# EAGLE design battery_tester (EAGLE 8.6.0)

## Sheet 1 of 2
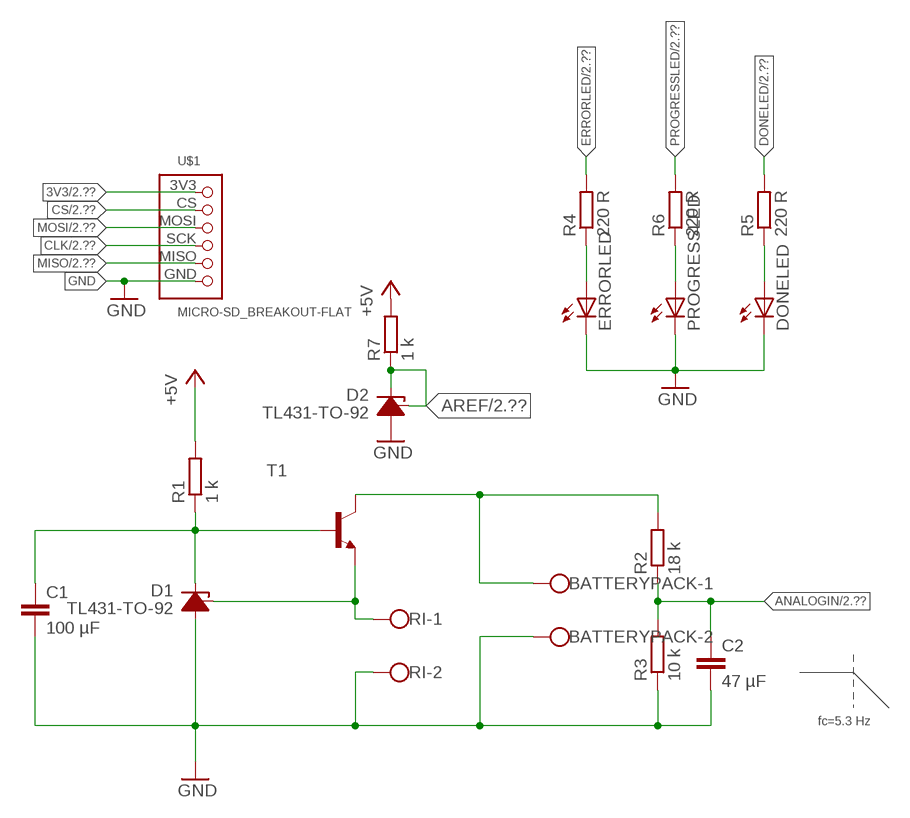
[diagram p0: schematic, sheet 1]

### Parts
BATTERYPACK  W237-102  [W237-102]
C1  100 µF  C-EUC1206  [C1206]
C2  47 µF  C-EUC1206  [C1206]
D1  TL431-TO-92  [TO-92]
D2  TL431-TO-92  [TO-92]
DONELED  LEDSML1206  [SML1206]
ERRORLED  LEDSML1206  [SML1206]
PROGRESSLED  LEDSML1206  [SML1206]
R1  1 k  R-EU_R1206  [R1206]
R2  18 k  R-EU_R1206  [R1206]
R3  10 k  R-EU_R1206  [R1206]
R4  220 R  R-EU_R1206  [R1206]
R5  220 R  R-EU_R1206  [R1206]
R6  220 R  R-EU_R1206  [R1206]
R7  1 k  R-EU_R1206  [R1206]
RI  W237-102  [W237-102]
T1  -NPN-TO92  [TO92]
U$1  MICRO-SD_BREAKOUT-FLAT  [MICRO-SD_BREAKOUT_FLAT]

### Nets
3V3: U$1.3V3 ; also sheet 2
+5V: R1.2 R7.2 ; also sheet 2
ANALOGIN: C2.1 R2.1 R3.2 ; also sheet 2
AREF: D2.1(J) D2.3(K) R7.1 ; also sheet 2
BATTERYPACK+: BATTERYPACK.1 R2.2 T1.3(C)
CLK: U$1.SCK ; also sheet 2
CS: U$1.CS ; also sheet 2
DONELED: R5.2 ; also sheet 2
ERRORLED: R4.2 ; also sheet 2
GND: BATTERYPACK.2 C1.2 C2.2 D1.2(A) D2.2(A) DONELED.C ERRORLED.C PROGRESSLED.C R3.1 RI.2 U$1.GND ; also sheet 2
MISO: U$1.MISO ; also sheet 2
MOSI: U$1.MOSI ; also sheet 2
N$1: C1.1 D1.3(K) R1.1 T1.2(B)
N$2: ERRORLED.A R4.1
N$3: D1.1(J) RI.1 T1.1(E)
N$4: PROGRESSLED.A R6.1
N$5: DONELED.A R5.1
PROGRESSLED: R6.2 ; also sheet 2

### Notes on the sheet
- fc=5.3 Hz

## Sheet 2 of 2
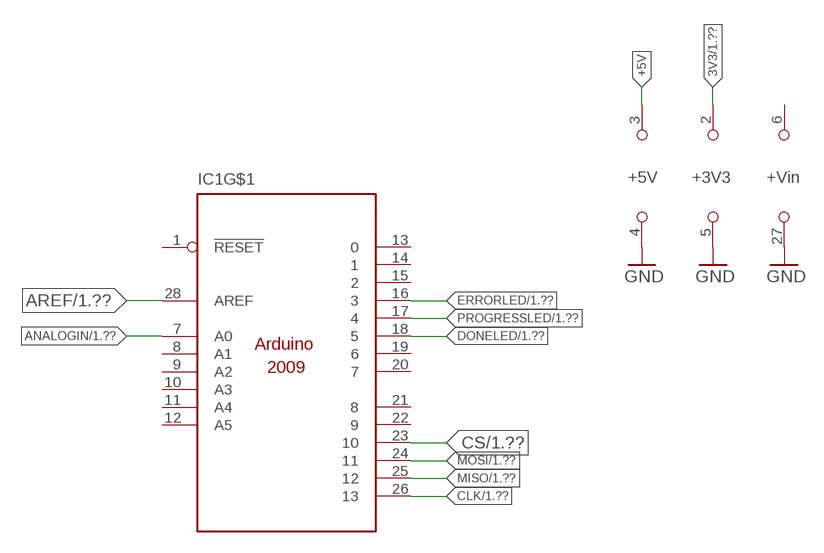
[diagram p1: schematic, sheet 2]

### Parts
IC1  ARDUINO2009_22  [ARDUINO2009_2]

### Nets
3V3: IC1.2(+3V3) ; also sheet 1
+5V: IC1.3(+5V) ; also sheet 1
ANALOGIN: IC1.7(A0) ; also sheet 1
AREF: IC1.28(AREF) ; also sheet 1
CLK: IC1.26 ; also sheet 1
CS: IC1.23 ; also sheet 1
DONELED: IC1.18 ; also sheet 1
ERRORLED: IC1.16 ; also sheet 1
GND: IC1.4(GND) IC1.5(GND) IC1.27(GND) ; also sheet 1
MISO: IC1.25 ; also sheet 1
MOSI: IC1.24 ; also sheet 1
PROGRESSLED: IC1.17 ; also sheet 1
Unconnected: IC1.1(!RESET) IC1.8(A1) IC1.9(A2) IC1.10(A3) IC1.11(A4) IC1.12(A5) IC1.13 IC1.14 IC1.15 IC1.19 IC1.20 IC1.21 IC1.22

## Power pins joined to a net without a drawn wire
+VIN: IC1.6(+VIN)

## Library data of the parts
BATTERYPACK RI = con-wago-500:W237-102: WAGO SCREW CLAMP; MPN: 237-102; OC_FARNELL: unknown; OC_NEWARK: 70K9898
C1 C2 = resistor:C-EU: CAPACITOR, European symbol
D1 D2 = upra_lib4eagle:TL431: TL431 Adjustable Shunt Regulator
DONELED ERRORLED PROGRESSLED = led:LED: LED OSRAM: - CHIPLED LG R971, LG N971, LY N971, LG Q971, LY Q971, LO R971, LY R971 LH N974, LH R974 LS Q976, LO Q976, LY Q976 LO Q996 - Hyper CHIPLED LW Q18S LB Q993, LB Q99A, LB R99A - SideLED LS A670, LO A670, LY A670, LG A670, LP A670 LB A673, LV A673, LT A673, LW A673 LH A674 LY A675 LS A676, LA A676, LO A676, LY A676, LW A676 LS A679, LY A679, LG A679 - Hyper Micro SIDELED® LS Y876, LA Y876, LO Y876, LY Y876 LT Y87S - SmartLED LW L88C, LW L88S LB L89C, LB L89S, LG L890 LS L89K, LO L89K, LY L89K LS L896, LA L896, LO L896, LY L896 - TOPLED LS T670, LO T670, LY T670, LG T670, LP T670 LSG T670, LSP T670, LSY T670, LOP T670, LYG T670 LG T671, LOG T671, LSG T671 LB T673, LV T673, LT T673, LW T673 LH T674 LS T676, LA T676, LO T676, LY T676, LB T676, LH T676, LSB T676, LW T676 LB T67C, LV T67C, LT T67C, LS T67K, LO T67K, LY T67K, LW E67C LS E67B, LA E67B, LO E67B, LY E67B, LB E67C, LV E67C, LT E67C LW T67C LS T679, LY T679, LG T679 LS T770, LO T770, LY T770, LG T770, LP T770 LB T773, LV T773, LT T773, LW T773 LH T774 LS E675, LA E675, LY E675, LS T675 LS T776, LA T776, LO T776, LY T776, LB T776 LHGB T686 LT T68C, LB T68C - Hyper Mini TOPLED® LB M676 - Mini TOPLED Santana® LG M470 LS M47K, LO M47K, LY M47K Source: http://www.osram.convergy.de LUXEON: - LUMILED® LXK2-PW12-R00, LXK2-PW12-S00, LXK2-PW14-U00, LXK2-PW14-V00 LXK2-PM12-R00, LXK2-PM12-S00, LXK2-PM14-U00 LXK2-PE12-Q00, LXK2-PE12-R00, LXK2-PE12-S00, LXK2-PE14-T00, LXK2-PE14-U00 LXK2-PB12-K00, LXK2-PB12-L00, LXK2-PB12-M00, LXK2-PB14-N00, LXK2-PB14-P00, LXK2-PB14-Q00 LXK2-PR12-L00, LXK2-PR12-M00, LXK2-PR14-Q00, LXK2-PR14-R00 LXK2-PD12-Q00, LXK2-PD12-R00, LXK2-PD12-S00 LXK2-PH12-R00, LXK2-PH12-S00 LXK2-PL12-P00, LXK2-PL12-Q00, LXK2-PL12-R00 Source: www.luxeon.com KINGBRIGHT: KA-3528ASYC Source: www.kingbright.com
IC1 = arduino:ARDUINO2009_2: The Arduino Duemilanove ("2009") is a microcontroller board based on the ATmega168 or ATmega328. - 14 digital input/output pins (of which 6 can be used as PWM outputs) - 6 analog inputs, a 16 MHz crystal oscillator - USB connection - power jack - ISP header - reset button It contains everything needed to support the microcontroller; simply connect it to a computer with a USB cable or power it with a AC-to-DC adapter or battery to get started http://arduino.cc/en/Main/ArduinoBoardDuemilanove
R1-R7 = resistor:R-EU_: RESISTOR, European symbol
T1 = transistor:*-NPN-: NPN Transistror BF959 corrected 2008.03.06
U$1 = upra_lib4eagle:MICRO-SD_BREAKOUT: Micro SD Card Breakout Board SPI port breakout board for SD Card. (Arduino Compatible) PINHEAD - Mounting with original pinheader (SD Card connector facing towards PCB) FLAT - Mounting with modified pinheader (Breakout PCB facing towards UPRA PCB)

## Board
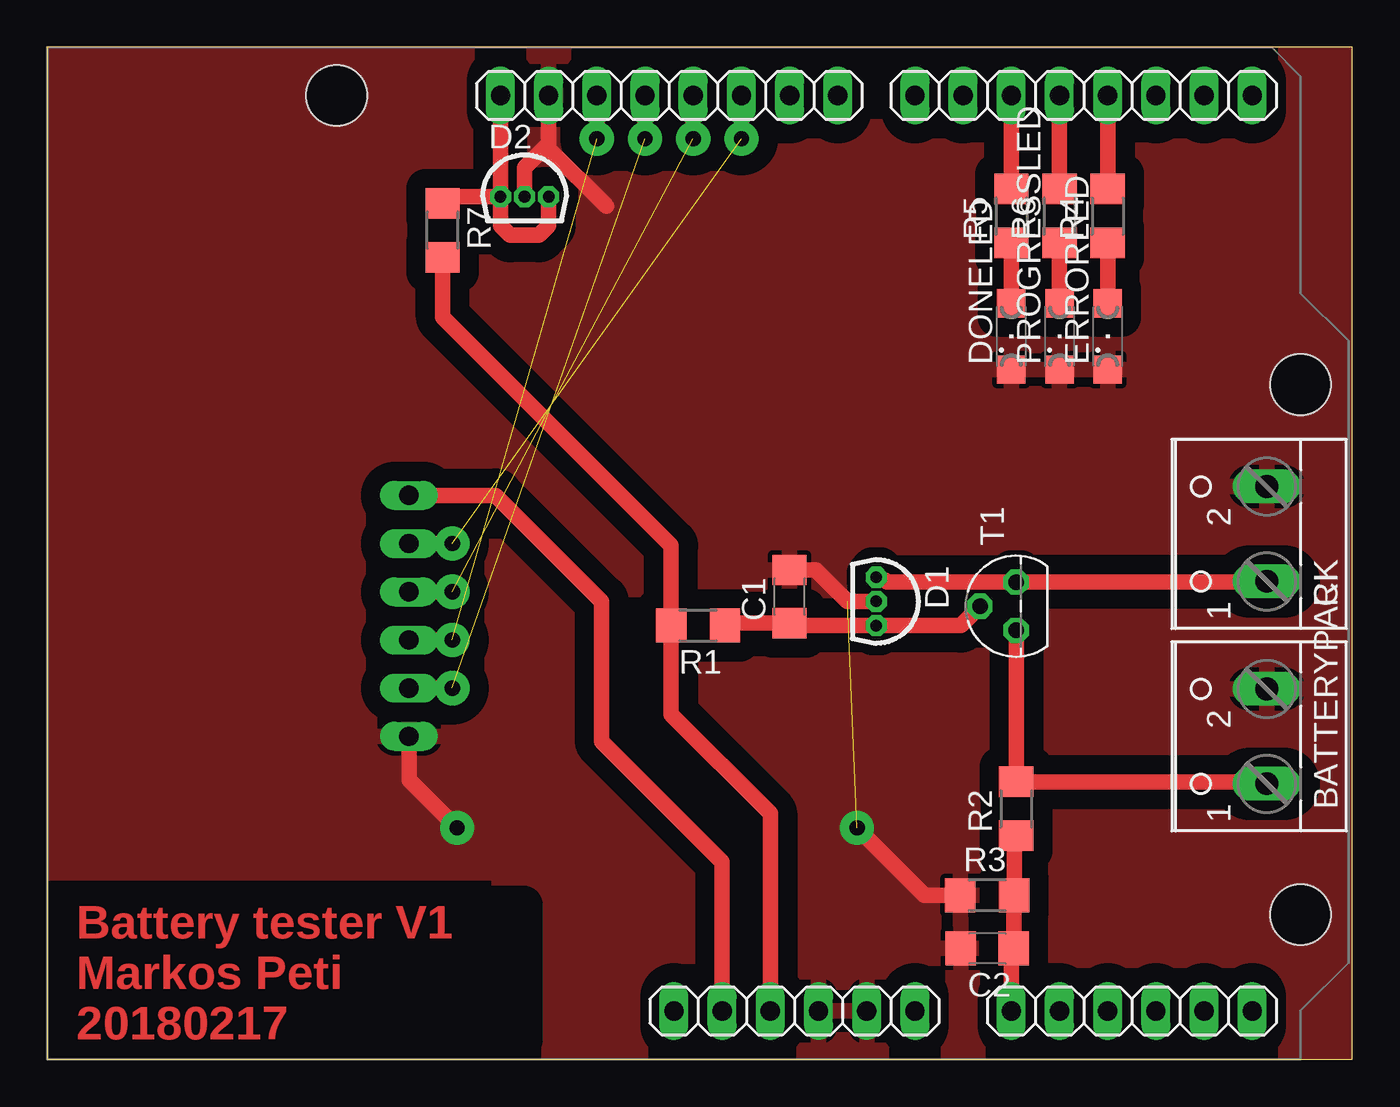
[diagram p2: board, top side]
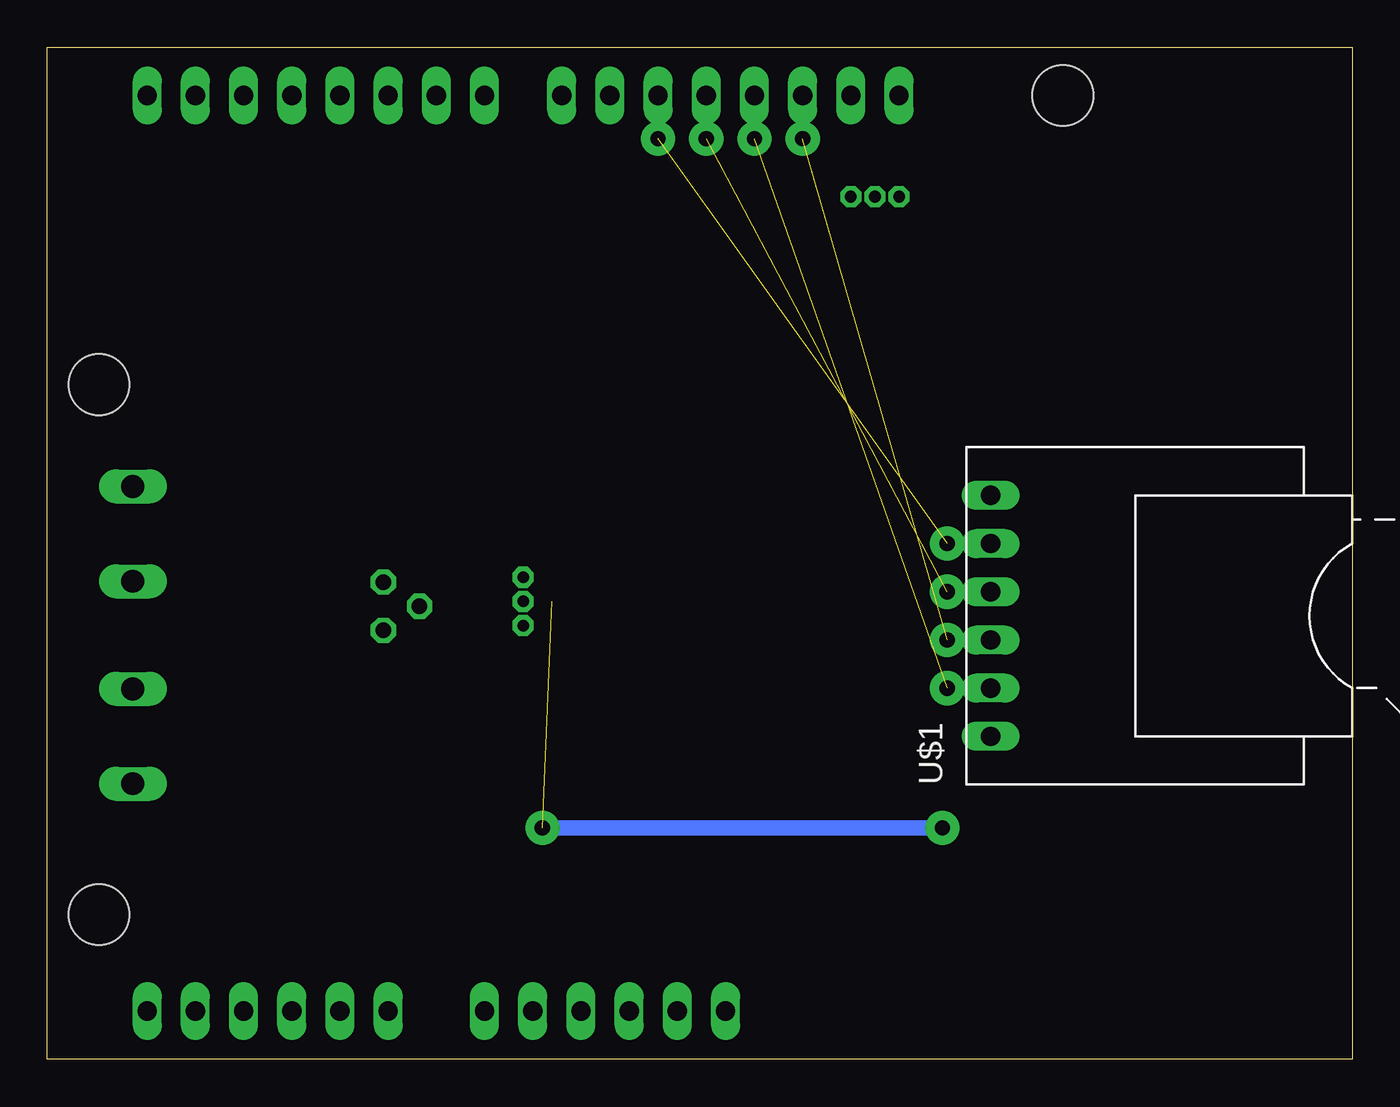
[diagram p3: board, bottom side, seen from below]

Size 68.76 x 53.33 mm. Coordinates in mm from the lower left corner, seen from the top.
Outline: 0,0 68.76,0 68.76,53.33 0,53.33 0,0
Copper layers (1*16): Top 0.035mm / dielectric 1.5mm / Bottom 0.035mm
Design rules "default *": minimum track width 6mil, minimum drill 0.35mm, track to track 40mil, track to pad 40mil, pad to pad 6mil, via to via 6mil, smd to smd 6mil, copper to edge 1mil, drill to drill 6mil, minimum pad ring 10mil, minimum via ring 8mil, stop-mask expansion 4mil, vias tented up to drill 0mil, thermal gap 10mil
tRestrict: area 0.3,-1 to 23.4,9.4

### Footprints (pad centres in the part's own frame; a part is rotated, then mirrored left to right if it is on the bottom)
W237-102 = drill 1.194 long: 1 -2.5,-1.27; 2 2.5,-1.27
C1206 = smd 1.6 x 1.8: 1 -1.4,0; 2 1.4,0
TO-92 = drill 0.61 octagon: 1 -1.27,0; 2 0,0; 3 1.27,0
SML1206 = smd 1.5 x 1.5: A 1.75,0; C -1.75,0
ARDUINO2009_2 = drill 1.016 long: 1 33.02,2.54; 2 35.56,2.54; 3 38.1,2.54; 4 40.64,2.54; 5 43.18,2.54; 6 45.72,2.54; 7 50.8,2.54; 8 53.34,2.54; 9 55.88,2.54; 10 58.42,2.54; 11 60.96,2.54; 12 63.5,2.54; 13 63.5,50.8; 14 60.96,50.8; 15 58.42,50.8; 16 55.88,50.8; 17 53.34,50.8; 18 50.8,50.8; 19 48.26,50.8; 20 45.72,50.8; 21 41.656,50.8; 22 39.116,50.8; 23 36.576,50.8; 24 34.036,50.8; 25 31.496,50.8; 26 28.956,50.8; 27 26.416,50.8; 28 23.876,50.8 | hole 3.2: 15.24,50.8; 66.04,35.56; 66.04,7.62
R1206 = smd 1.6 x 1.803: 1 -1.422,0; 2 1.422,0
TO92 = drill 0.813 octagon: 1 1.27,0; 2 0,1.905; 3 -1.27,0
MICRO-SD_BREAKOUT_FLAT = drill 1.016 long: 3V3 6.35,0; CS 3.81,0; GND -6.35,0; MISO -3.81,0; MOSI 1.27,0; SCK -1.27,0

### Placement (x,y rotation side)
BATTERYPACK  62.99,17.02 90 top
C1  39.12,24.38 90 top
C2  49.53,5.84 180 top
D1  43.69,24.13 270 top
D2  25.15,45.47 0 top
DONELED  50.8,38.1 90 top
ERRORLED  55.88,38.1 90 top
IC1  0,0 0 top
PROGRESSLED  53.34,38.1 90 top
R1  34.29,22.86 180 top
R2  51.05,13.21 90 top
R3  49.53,8.64 0 top
R4  55.88,44.45 90 top
R5  50.8,44.45 90 top
R6  53.34,44.45 90 top
R7  20.83,43.69 270 top
RI  62.99,27.69 90 top
T1  51.05,23.88 90 top
U$1  19.05,23.37 90 bottom

### Tracks (layer width: path | path; a pad name or v marks a point on that pad's centre or on a via)
3V3
  Top 0.813: IC1.2 35.56,10.41 29.21,16.76 29.21,24.13 23.62,29.72 U$1.3V3
+5V
  Top 0.813: IC1.3 38.1,12.95 32.87,18.19 R1.2 32.87,27.08 20.83,39.12 R7.2
ANALOGIN
  Top 0.813: IC1.7 50.8,5.71 C2.1 50.93,8.61 R3.2 50.95,11.68 R2.1
AREF
  Top 0.813: R7.1 21.18,45.47 D2.1 | D2.1 IC1.28 | D2.3 26.42,43.94 25.91,43.43 24.38,43.43 23.88,43.94 D2.1
BATTERYPACK+
  Top 0.813: T1.3 R2.2 64.15,14.63 BATTERYPACK.1
CLK  (via drill 0.8 pad 1.8)  (1 unrouted)
  Top 0.813: IC1.26 v28.96,48.51 | U$1.SCK v21.34,22.1
CS  (via drill 0.8 pad 1.8)  (1 unrouted)
  Top 0.813: IC1.23 v36.58,48.51 | U$1.CS v21.34,27.18
DONELED
  Top 0.813: R5.2 IC1.18
ERRORLED
  Top 0.813: IC1.16 R4.2
GND  (via drill 0.8 pad 1.8)  (1 unrouted)
  Top 0.813: D2.2 25.15,46.99 26.42,48.26 | D1.2 42.16,24.13 40.51,25.78 C1.2 | IC1.27 26.42,48.01 29.46,44.96 | U$1.GND 19.05,14.73 v21.59,12.19 | v42.67,12.19 46.23,8.64 R3.1
  Bottom 0.813: v21.59,12.19 v42.67,12.19
  pour Top: -0.51,54.86 71.88,54.86 71.88,-4.06 -0.51,-4.06
MISO  (via drill 0.8 pad 1.8)  (1 unrouted)
  Top 0.813: IC1.25 v31.5,48.51 | U$1.MISO v21.34,19.56
MOSI  (via drill 0.8 pad 1.8)  (1 unrouted)
  Top 0.813: IC1.24 v34.04,48.51 | U$1.MOSI v21.34,24.64
N$1
  Top 0.813: T1.2 48.13,22.86 D1.3 39.24,22.86 C1.1 35.84,22.98 R1.1
N$2
  Top 0.813: R4.1 ERRORLED.A
N$3
  Top 0.813: D1.1 43.84,25.25 44.15,25.25 44.25,25.15 T1.1 64.22,25.15 RI.1
N$4
  Top 0.813: R6.1 PROGRESSLED.A
N$5
  Top 0.813: R5.1 DONELED.A
PROGRESSLED
  Top 0.813: IC1.17 R6.2

### Text on the board
Top: Battery tester V1 / Markos Peti / 20180217